# EAGLE schematic HSDL-9100 (EAGLE 6.4)
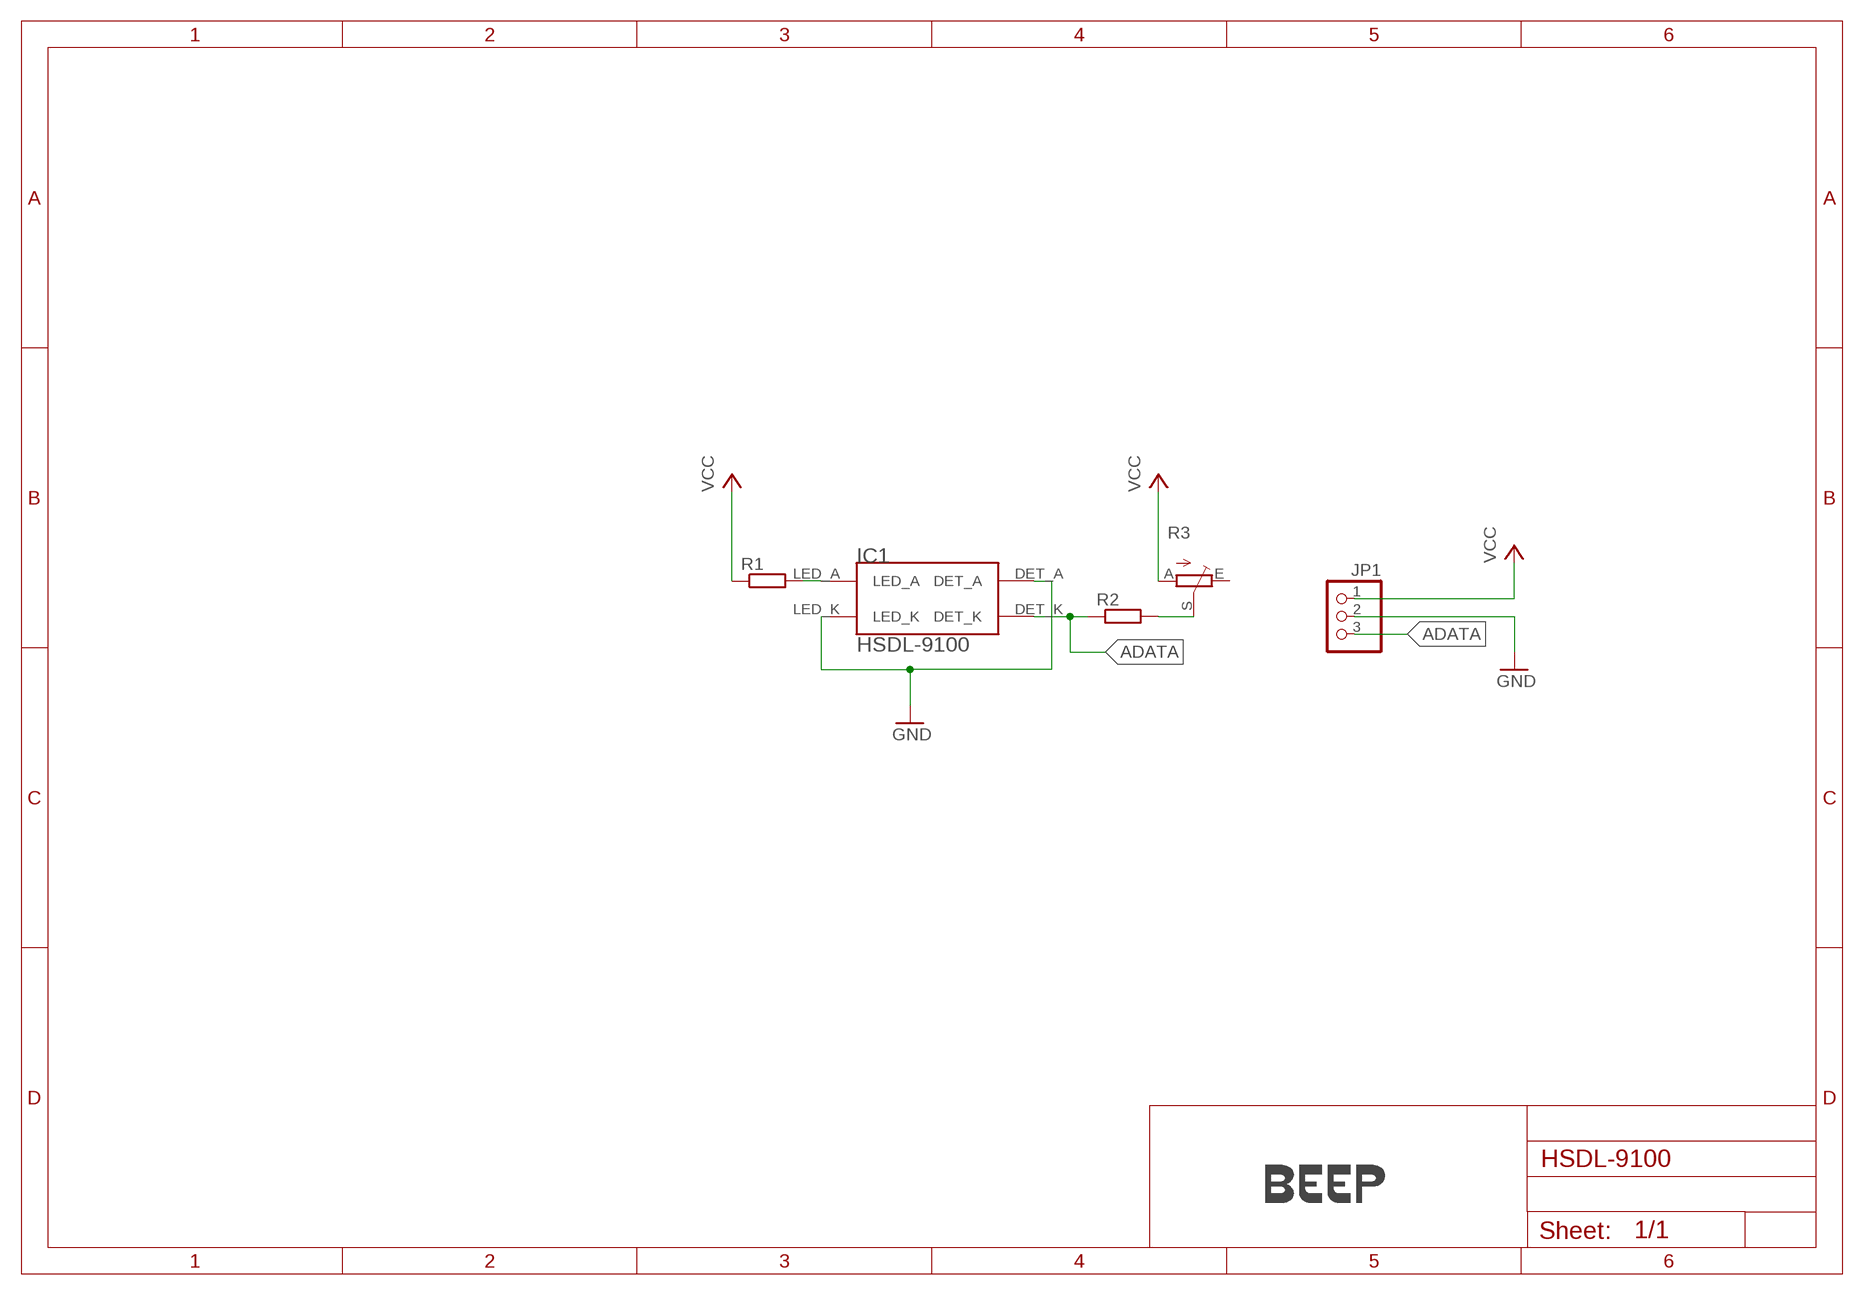
[diagram p0: schematic, sheet 1]

## Parts
IC1  HSDL-9100  [HSDL-9100]
JP1  PINHD-1X3  [1X03]
R1  R-EU_M0805  [M0805]
R2  R-EU_M0805  [M0805]
R3  TRIM_EU-B25P  [B25P]
U$1  LOGO-COPPER3  [COPPER3]

## Nets
ADATA: IC1.DET_K JP1.3 R2.1
GND: IC1.DET_A IC1.LED_K JP1.2
N$3: IC1.LED_A R1.2
N$5: R2.2 R3.S
VCC: JP1.1 R1.1 R3.A
Unconnected: R3.E

## Library data of the parts
IC1 = BEEP:HSDL-9100
JP1 = pinhead:PINHD-1X3: PIN HEADER
R1 R2 = rcl:R-EU_: RESISTOR, European symbol
R3 = pot:TRIM_EU-: POTENTIOMETER
U$1 = Branding:LOGO-COPPER